# EAGLE schematic project-alpha (EAGLE 6.4)
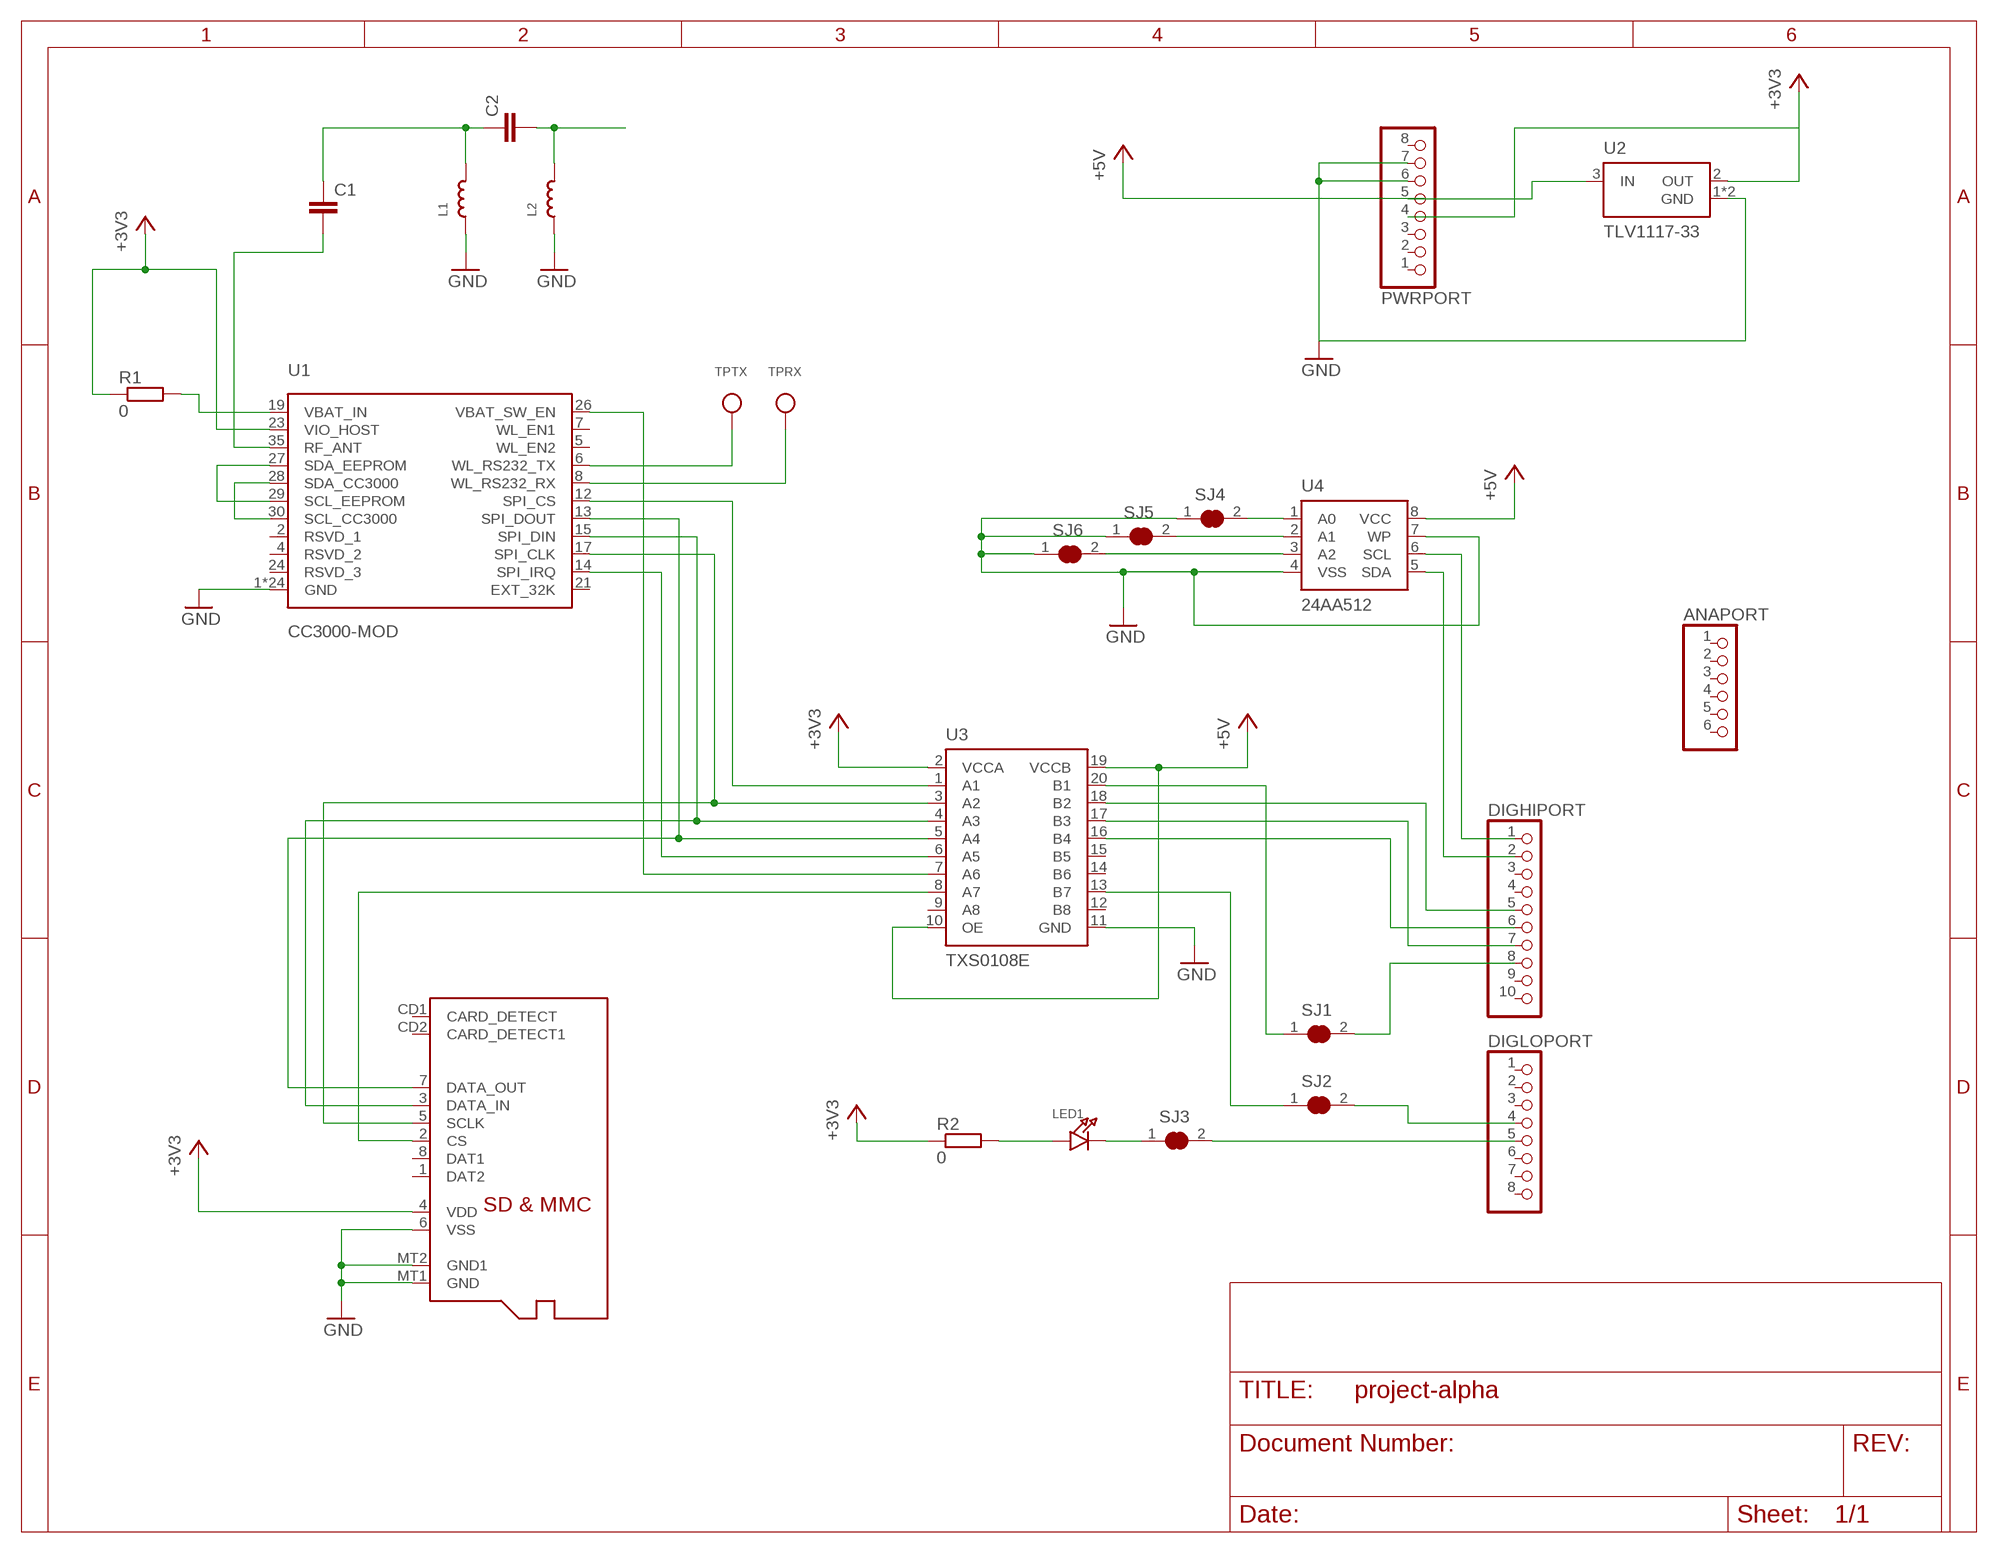
[diagram p0: schematic, sheet 1]

## Parts
ANAPORT  PINHD-1X6  [1X06]
C1  C-EUC0402  [C0402]
C2  C-EUC0402  [C0402]
DIGHIPORT  PINHD-1X10  [1X10]
DIGLOPORT  PINHD-1X8  [1X08]
L1  INDUCTOR_0402  [_0402]
L2  INDUCTOR_0402  [_0402]
LED1  LED0603_NOOUTLINE  [CHIPLED_0603_NOOUTLINE]
PWRPORT  PINHD-1X8  [1X08]
R1  0  R-EU_R0402  [R0402]
R2  0  R-EU_R0402  [R0402]
SJ1  SOLDERJUMPER_CLOSED  [SOLDERJUMPER_CLOSEDWIRE]
SJ2  SOLDERJUMPER_CLOSED  [SOLDERJUMPER_CLOSEDWIRE]
SJ3  SOLDERJUMPER_CLOSED  [SOLDERJUMPER_CLOSEDWIRE]
SJ4  SOLDERJUMPER_CLOSED  [SOLDERJUMPER_CLOSEDWIRE]
SJ5  SOLDERJUMPER_CLOSED  [SOLDERJUMPER_CLOSEDWIRE]
SJ6  SOLDERJUMPER_CLOSED  [SOLDERJUMPER_CLOSEDWIRE]
TPRX  TESTPOINT  [TESTPOINT_SMT]
TPTX  TESTPOINT  [TESTPOINT_SMT]
U1  CC3000-MOD  [CC3000-LGA]
U2  TLV1117-33  [SOT223-R]
U3  TXS0108E  [TSSOP20]
U4  24AA512  [TSSOP8]
U$2  MICROSD  [MICROSD]

## Nets
+3V3: PWRPORT.4 R1.1 R2.1 U1.23(VIO_HOST) U2.2(OUT) U3.2(VCCA) U$2.4(VDD)
+5V: U3.10(OE) U3.19(VCCB) U4.8(VCC)
GND: L1.1 L2.1 PWRPORT.6 PWRPORT.7 SJ4.1 SJ5.1 SJ6.1 U1.1(GND) U1.9(GND) U1.10(GND) U1.11(GND) U1.16(GND) U1.18(GND) U1.20(GND) U1.22(GND) U1.25(GND) U1.31(GND) U1.32(GND) U1.33(GND) U1.34(GND) U1.36(GND) U1.37(GND) U1.38(GND) U1.39(GND) U1.40(GND) U1.41(GND) U1.42(GND) U1.43(GND) U1.44(GND) U1.45(GND) U1.46(GND) U2.1(GND) U2.4(GND) U3.11(GND) U4.4(VSS) U4.7(WP) U$2.6(VSS) U$2.MT1(GND) U$2.MT2(GND1)
N$1: PWRPORT.5 U2.3(IN)
N$2: U1.12(SPI_CS) U3.1(A1)
N$3: U1.17(SPI_CLK) U3.3(A2) U$2.5(SCLK)
N$4: U1.15(SPI_DIN) U3.4(A3) U$2.3(DATA_IN)
N$5: U1.13(SPI_DOUT) U3.5(A4) U$2.7(DATA_OUT)
N$6: U1.14(SPI_IRQ) U3.6(A5)
N$7: U1.26(VBAT_SW_EN) U3.7(A6)
N$8: C1.2 U1.35(RF_ANT)
N$9: R1.2 U1.19(VBAT_IN)
N$10: C1.1 C2.1 L1.2
N$11: DIGHIPORT.6 U3.16(B4)
N$12: U1.27(SDA_EEPROM) U1.29(SCL_EEPROM)
N$13: U1.28(SDA_CC3000) U1.30(SCL_CC3000)
N$14: DIGHIPORT.7 U3.17(B3)
N$15: DIGHIPORT.5 U3.18(B2)
N$16: U3.8(A7) U$2.2(CS)
N$17: SJ1.1 U3.20(B1)
N$18: DIGHIPORT.8 SJ1.2
N$19: SJ2.1 U3.13(B7)
N$20: DIGLOPORT.4 SJ2.2
N$21: LED1.A R2.2
N$22: LED1.C SJ3.1
N$23: DIGLOPORT.5 SJ3.2
N$24: SJ4.2 U4.1(A0)
N$25: SJ5.2 U4.2(A1)
N$26: SJ6.2 U4.3(A2)
N$27: DIGHIPORT.1 U4.6(SCL)
N$28: DIGHIPORT.2 U4.5(SDA)
N$29: C2.2 L2.2
N$30: TPTX.P$1 U1.6(WL_RS232_TX)
N$31: TPRX.P$1 U1.8(WL_RS232_RX)
Unconnected: ANAPORT.1 ANAPORT.2 ANAPORT.3 ANAPORT.4 ANAPORT.5 ANAPORT.6 DIGHIPORT.3 DIGHIPORT.4 DIGHIPORT.9 DIGHIPORT.10 DIGLOPORT.1 DIGLOPORT.2 DIGLOPORT.3 DIGLOPORT.6 DIGLOPORT.7 DIGLOPORT.8 PWRPORT.1 PWRPORT.2 PWRPORT.3 PWRPORT.8 U1.2(RSVD_1) U1.4(RSVD_2) U1.5(WL_EN2) U1.7(WL_EN1) U1.21(EXT_32K) U1.24(RSVD_3) U3.9(A8) U3.12(B8) U3.14(B6) U3.15(B5) U$2.1(DAT2) U$2.8(DAT1) U$2.CD1(CARD_DETECT) U$2.CD2(CARD_DETECT1)

## Library data of the parts
ANAPORT = pinhead:PINHD-1X6: PIN HEADER
C1 = resistor:C-EU: CAPACITOR, European symbol
C2 = rcl:C-EU: CAPACITOR, European symbol
DIGHIPORT = pinhead:PINHD-1X10: PIN HEADER
DIGLOPORT PWRPORT = pinhead:PINHD-1X8: PIN HEADER
L1 L2 = microbuilder:INDUCTOR: Inductors 0603: 10nH Ceramic Inductor - microwire antenna/RF (Digikey: 712-1434-2-ND) 0805: 560nH Ceramic Inductor - RF (Digikey: 553-1047-1-ND) 270nH Ceramic Inductor - Q = 40@250MHz, +-5%, 1 Ohm DC Resistance (Digikey: 535-10506-2-ND) 1007 (2518 Metric) SMT: 10µH 10% 250mOhm 820mA 1007 Inductor (Digikey: 587-2189-1-ND) 22µH 10% 500mOhm 580mA 1007 Inductor (Digikey: 587-2190-1-ND) 47µH 10% 950mOhm 420mA 1007 Inductor (Digikey: 587-2191-1-ND) 47µH 5% 100mOhm 1A 1008 Inductor (Digikey: 732-1816-1-ND) 5.0x5.0mm (Taiyo Yuden NR5040 Series) 6.8µH 20% 2.3A 64mOhm Inductor (Digikey: 587-2374-2-ND) 5.0x5.0mm (TDK VLC5045 Series) 4.7µH 20% 3.3A 34mOhm Inductor (Digikey: 445-6526-1-ND) 6.8µH 20% 2.7A 46mOhm Inductor (Digikey: 445-6527-1-ND) 6.0x6.0mm (TDK VLC6045 Series) 4.7µH 20% 3.8A 27mOhm Inductor (Digikey: 445-6538-2-ND) 6.8µH 20% 3A 41mOhm Inductor (Digikey: 445-6540-1-ND) 6.2µH 30% 2.2A 45mOhm Inductor (Digikey: SRR5028-6R2YCT-ND) - Not TDK VLC6045 but footprint should match 6.0x6.0mm (TDK SLF6045 Series) 6.8uH 30% 2A 33mOhm Inductor (Digikey: 445-4572-1-ND, Mouser: 810-SLF645T6R8N2R0PF)
LED1 = microbuilder:LED: LED 0603 - 0603 Surface Mount Package 2mA: Green LED - Low Power (3.9mcd, 2ma, 1.7Vf) - Digikey: 475-2709-2-ND Orange LED - Low Power (9.8mcd, 2ma, 1.8Vf) - Digikey: 475-1194-2-ND Red LED - Low Power (5mcd, 2ma, 1.8Vf) - Digikey: 475-1195-2-ND Yellow LED - Low Power (7mcd, 2ma, 1.8Vf) - Digikey: 475-1196-2-ND 5mA: Blue LED - Low Power (17mcd, 5ma, 2.9Vf) - Digikey: LNJ937W8CRACT-ND 0805 - 0805 Surface Mount Package 2mA: Red LED (8.8mcd, 2mA, 1.8Vf, Clear) - Low Power [Digikey: 475-2510-1-ND] Green LED (5mcd, 2mA, 1.8Vf, Clear) - Low Power [Digikey: 475-2730-1-ND] Yellow LED (11.3mcd, 2mA, 1.8Vf, Clear) - Low Power [Digikey: 475-2555-1-ND] 20mA: Red LED (104mcd, 20mA, Diffused) - LS R976 [Digikey: 475-1278-6-ND] Red LED (12mcd, 20mA, 2.0Vf, Clear) - APT2012EC [Digikey: 754-1128-1-ND] Green LED (15mcd, 20mA, 2.2Vf, Clear) - APT2012GC [Digikey: 754-1131-1-ND] Orange LED (160mcd, 20mA, 2.1Vf, Clear) - APT2012SECK [Digikey: 754-1130-1-ND] 1206 - 1206 Surface Mount Package Green LED (26mcd, 20mA, Diffused) - LG N971 [Digikey: 475-1407-6-ND] Red LED (15mcd, 20mA, Diffused) - LH N974 [Digikey: 475-1416-6-ND]
R1 R2 = resistor:R-EU_: RESISTOR, European symbol
SJ1-SJ6 = microbuilder:SOLDERJUMPER_CLOSED: Solder Jumper - Closed These solder jumpers are closed by default CLOSEDWIRE - 10 mil trace between pads that can be cut and resoldered later CLOSEDPERM - 63 mil trace between pads for a permanent connection (used to 'bridge' two signals, a shameless hack for Eagle). Can double as a test point as well (no cream layer)
TPRX TPTX = microbuilder:TESTPOINT: Test Point Various test points for characterisation and PCB testing TESTPOINT_SMT - Compact Surface Mount Test Point [Digikey: 5016KTR-ND]
U1 = eightbitlabs:CC3000-MOD
U2 = eightbitlabs:TLV1117-33: TLV1117-33 Fixed low-dropout voltage regulator 3.3V LDO Maximum 1.3V dropout at 800mA. TLV1117 Product Landing Page <http://www.ti.com/product/tlv1117>
U3 = eightbitlabs:TXS0108E: TXS0108E 8-bit bidirectional voltage-level translator for open-drain and push-pull applications 1.2V-3.6V VCCA 1.65V-5.5V VCCB TXS0108E Product Landing Page <http://www.ti.com/product/txs0108e>
U4 = eightbitlabs:24AA512
U$2 = adafruit:MICROSD: Micro-SD / Transflash card holder with SPI pinout For the 3M # 2908-05WB-MG and/or 4UCON #19656 push-push type